# EAGLE schematic new_power (EAGLE 6.4)
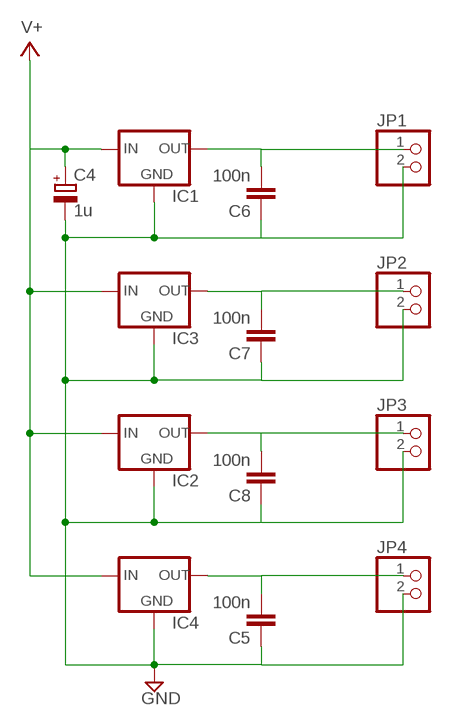
[diagram p0: schematic, sheet 1]

## Parts
C4  1u  CPOL-EUE2-4  [E2-4]
C5  100n  C-EU025-024X044  [C025-024X044]
C6  100n  C-EU025-024X044  [C025-024X044]
C7  100n  C-EU025-024X044  [C025-024X044]
C8  100n  C-EU025-024X044  [C025-024X044]
IC1  78XX-TO3  [TO3-78]
IC2  78XX-TO3  [TO3-78]
IC3  78XX-TO3  [TO3-78]
IC4  78XX-TO3  [TO3-78]
JP1  PINHD-1X2  [1X02]
JP2  PINHD-1X2  [1X02]
JP3  PINHD-1X2  [1X02]
JP4  PINHD-1X2  [1X02]

## Nets
GND: C4.- C5.1 C6.1 C7.1 C8.1 IC1.3(GND) IC2.3(GND) IC3.3(GND) IC4.3(GND) JP1.2 JP2.2 JP3.2 JP4.2
N$2: C6.2 IC1.1(OUT) JP1.1
N$3: C7.2 IC3.1(OUT) JP2.1
N$5: C8.2 IC2.1(OUT) JP3.1
N$6: C5.2 IC4.1(OUT) JP4.1
V+: C4.+ IC1.2(IN) IC2.2(IN) IC3.2(IN) IC4.2(IN)

## Library data of the parts
C4 = rcl:CPOL-EU: POLARIZED CAPACITOR, European symbol
C5-C8 = rcl:C-EU: CAPACITOR, European symbol
IC1-IC4 = v-reg:78XX-TO3: VOLTAGE REGULATOR
JP1-JP4 = pinhead:PINHD-1X2: PIN HEADER